# EAGLE design panel (EAGLE 9.4.1)
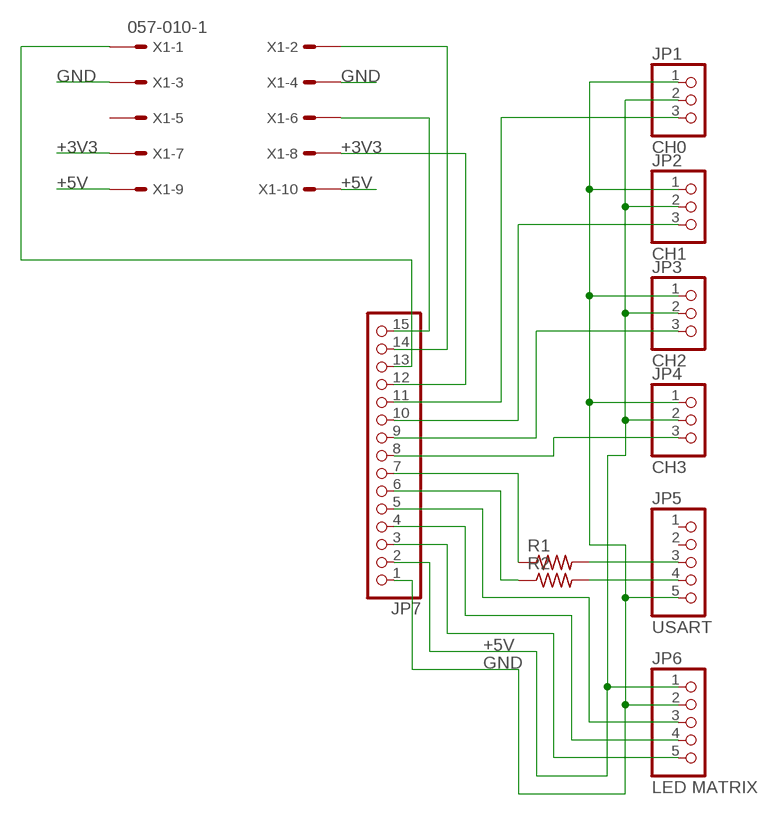
[diagram p0: schematic, sheet 1]

## Parts
JP1  CH0  PINHD-1X3  [1X03]
JP2  CH1  PINHD-1X3  [1X03]
JP3  CH2  PINHD-1X3  [1X03]
JP4  CH3  PINHD-1X3  [1X03]
JP5  USART  PINHD-1X5  [1X05]
JP6  LED MATRIX  PINHD-1X5  [1X05]
JP7  PINHD-1X15  [1X15]
R1  R-US_0204/7  [0204/7]
R2  R-US_0204/7  [0204/7]
X1  057-010-1  [057-010-1]

## Nets
+3V3: JP7.12 X1.7 X1.8
+5V: JP1.2 JP2.2 JP3.2 JP4.2 JP6.1 JP7.2 X1.9 X1.10
GND: JP1.1 JP2.1 JP3.1 JP4.1 JP5.5 JP6.2 JP7.1 X1.3 X1.4
N$1: JP5.3 R1.2
N$4: JP7.6 R2.1
N$5: JP5.4 R2.2
N$6: JP1.3 JP7.11
N$7: JP2.3 JP7.10
N$8: JP4.3 JP7.8
N$9: JP3.3 JP7.9
N$10: JP7.7 R1.1
N$11: JP6.3 JP7.5
N$12: JP6.4 JP7.4
N$13: JP6.5 JP7.3
N$14: JP7.13 X1.1
N$15: JP7.14 X1.2
N$16: JP7.15 X1.6
Unconnected: JP5.1 JP5.2 X1.5

## Library data of the parts
JP1-JP4 = pinhead:PINHD-1X3: PIN HEADER
JP5 JP6 = pinhead:PINHD-1X5: PIN HEADER
JP7 = pinhead:PINHD-1X15: PIN HEADER
R1 R2 = rcl:R-US_: RESISTOR, American symbol; SPICEPREFIX: R
X1 = con-panduit:057-010-: CONNECTOR 10-pin series 057 contact pc board low profile headers; OC_FARNELL: unknown; OC_NEWARK: unknown

## Board
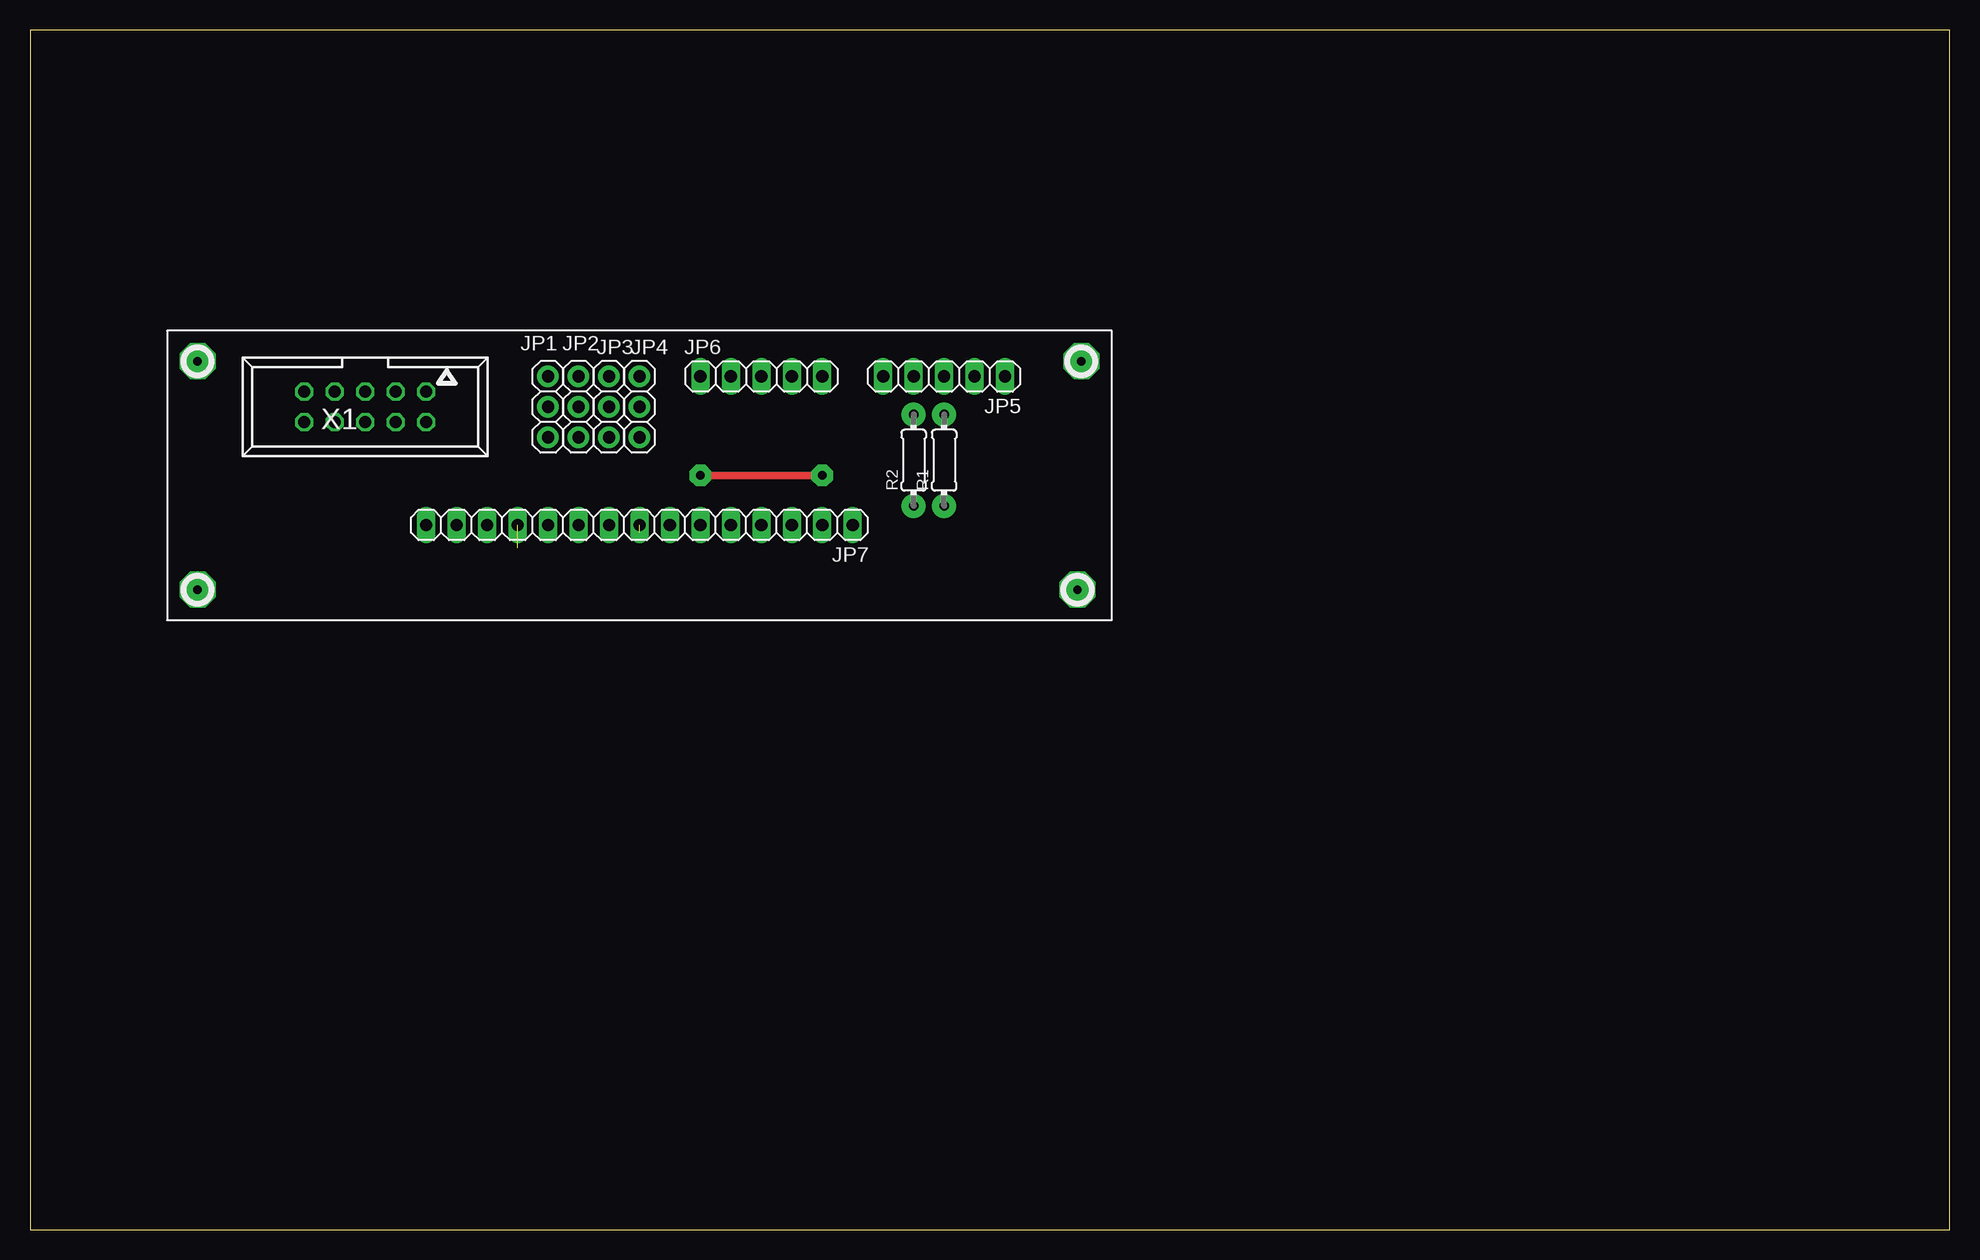
[diagram p1: board, top side]
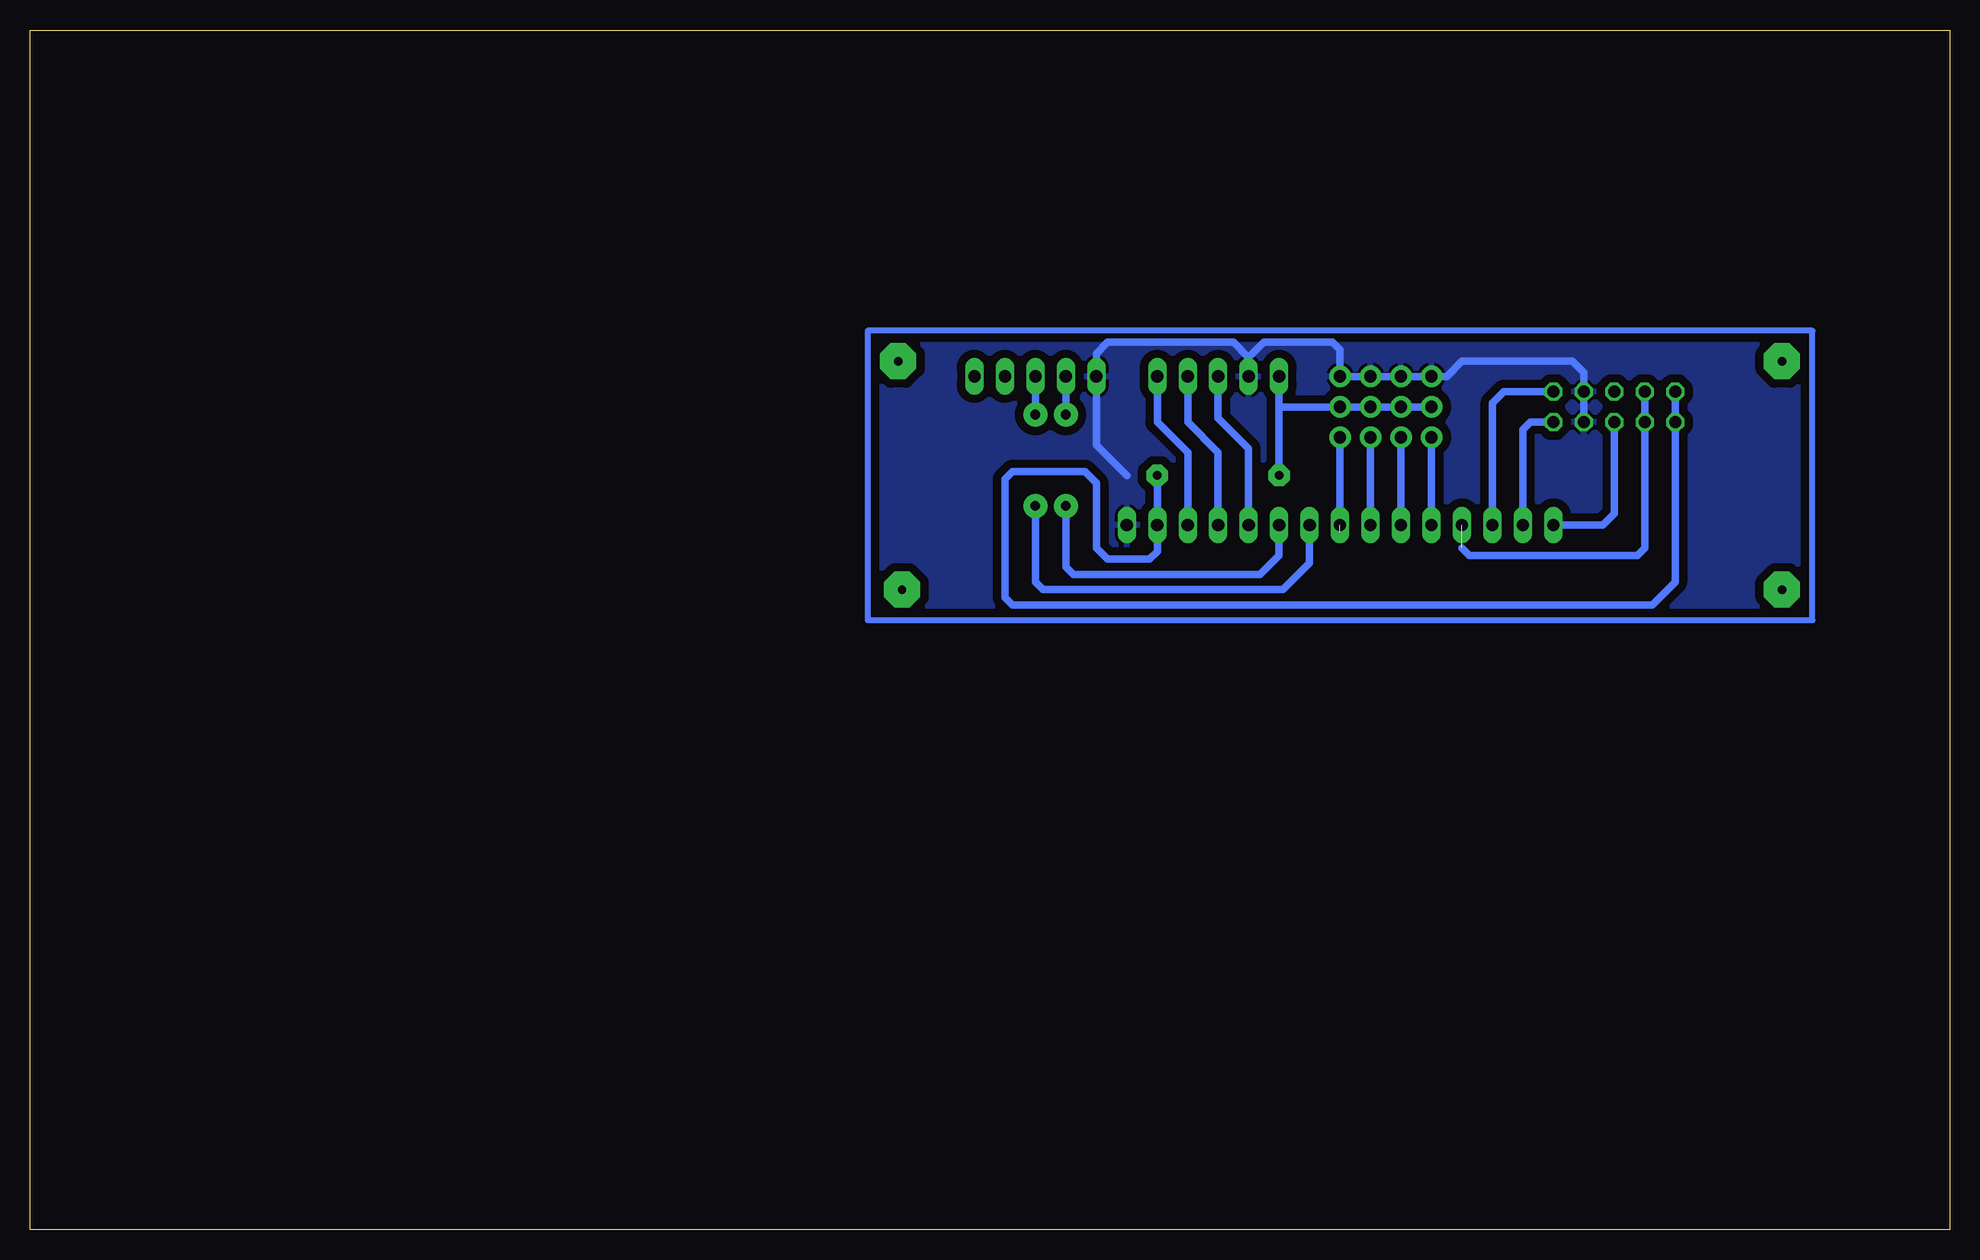
[diagram p2: board, bottom side, seen from below]

Size 160 x 100 mm. Coordinates in mm from the lower left corner, seen from the top.
Outline: 0,0 160,0 160,100 0,100 0,0
Copper layers (1*16): Top 0.035mm / dielectric 1.5mm / Bottom 0.035mm
Design rules "default": minimum track width 6mil, minimum drill 0.35mm, track to track 6mil, track to pad 6mil, pad to pad 6mil, via to via 6mil, smd to smd 6mil, copper to edge 40mil, drill to drill 6mil, minimum pad ring 10mil, minimum via ring 8mil, stop-mask expansion 4mil, vias tented up to drill 0mil, thermal gap 10mil

### Footprints (pad centres in the part's own frame; a part is rotated, then mirrored left to right if it is on the bottom)
1X03 = drill 1.016 pad 1.8: 1 -2.54,0; 2 0,0; 3 2.54,0
1X05 = drill 1.016 long: 1 -5.08,0; 2 -2.54,0; 3 0,0; 4 2.54,0; 5 5.08,0
1X15 = drill 1.016 long: 1 -17.78,0; 2 -15.24,0; 3 -12.7,0; 4 -10.16,0; 5 -7.62,0; 6 -5.08,0; 7 -2.54,0; 8 0,0; 9 2.54,0; 10 5.08,0; 11 7.62,0; 12 10.16,0; 13 12.7,0; 14 15.24,0; 15 17.78,0
0204/7 = drill 0.813 pad 2: 1 -3.81,0; 2 3.81,0
057-010-1 = drill 1 octagon: 1 -5.08,-1.27; 2 -5.08,1.27; 3 -2.54,-1.27; 4 -2.54,1.27; 5 0,-1.27; 6 0,1.27; 7 2.54,-1.27; 8 2.54,1.27; 9 5.08,-1.27; 10 5.08,1.27

### Placement (x,y rotation side)
JP1  43.18,68.58 270 top
JP2  45.72,68.58 270 top
JP3  48.26,68.58 270 top
JP4  50.8,68.58 270 top
JP5  76.2,71.12 180 top
JP6  60.96,71.12 0 top
JP7  50.8,58.74 180 top
R1  76.2,64.14 90 top
R2  73.66,64.14 90 top
X1  27.94,68.58 180 top

### Tracks (layer width: path | path; a pad name or v marks a point on that pad's centre or on a via)
+3V3  (1 unrouted)
  Bottom 0.61: X1.7 X1.8 25.4,56.83 26.04,56.2 40.01,56.2 40.64,56.83
+5V  (via drill 0.7 pad 1.8)
  Top 0.61: v66.04,62.87 v55.88,62.87
  Bottom 0.61: JP1.2 JP2.2 JP3.2 JP4.2 55.88,68.58 JP6.1 v55.88,62.87 | X1.9 X1.10 22.86,53.98 24.77,52.07 78.11,52.07 78.74,52.7 78.74,62.55 78.11,63.18 72.07,63.18 71.12,62.23 71.12,56.83 70.17,55.88 66.67,55.88 66.04,56.52 JP7.2 v66.04,62.87
GND
  Bottom 0.61: X1.4 X1.3 30.48,71.44 31.43,72.39 40.64,72.39 41.91,71.12 JP1.1 JP2.1 JP3.1 JP4.1 50.8,73.34 51.44,73.98 57.15,73.98 58.42,72.71 | JP6.2 58.42,72.71 | 58.42,72.71 59.69,73.98 70.17,73.98 71.12,73.03 JP5.5 71.12,65.41 68.58,62.87
  pour Bottom (isolate 0.7): 90.17,50.8 11.43,50.8 11.43,74.93 90.17,74.93
N$1
  Bottom 0.61: R1.2 JP5.3
N$2  (via drill 0.7 pad 3)
  other vias: 13.97,72.39
N$3  (via drill 0.7 pad 3)
  other vias: 87.63,72.39
N$4
  Bottom 0.61: R2.1 73.66,55.24 73.03,54.61 57.47,54.61 55.88,56.2 JP7.6
N$5
  Bottom 0.61: R2.2 JP5.4
N$6
  Bottom 0.61: JP1.3 JP7.11
N$7
  Bottom 0.61: JP7.10 JP2.3
N$8  (1 unrouted)
  Bottom 0.61: JP4.3 50.8,58.1
N$9
  Bottom 0.61: JP7.9 JP3.3
N$10
  Bottom 0.61: R1.1 76.2,53.98 75.56,53.34 55.56,53.34 53.34,55.56 JP7.7
N$11
  Bottom 0.61: JP6.3 60.96,67.63 58.42,65.09 JP7.5
N$12
  Bottom 0.61: JP6.4 63.5,67.31 60.96,64.77 JP7.4
N$13
  Bottom 0.61: JP6.5 66.04,67.31 63.5,64.77 JP7.3
N$14
  Bottom 0.61: X1.1 37.15,69.85 38.1,68.9 JP7.13
N$15
  Bottom 0.61: X1.2 34.92,67.31 35.56,66.67 JP7.14
N$16
  Bottom 0.61: X1.6 27.94,59.69 28.89,58.74 JP7.15
N$17  (via drill 0.7 pad 3)
  other vias: 87.31,53.34
N$18  (via drill 0.7 pad 3)
  other vias: 13.97,53.34
N$19
  Bottom 0.508: 11.43,74.93 90.17,74.93 90.17,50.8 11.43,50.8 11.43,74.93